# Altium schematic sheet Flash.SchDoc
size A; SheetNumber: 4; SheetTotal: 5
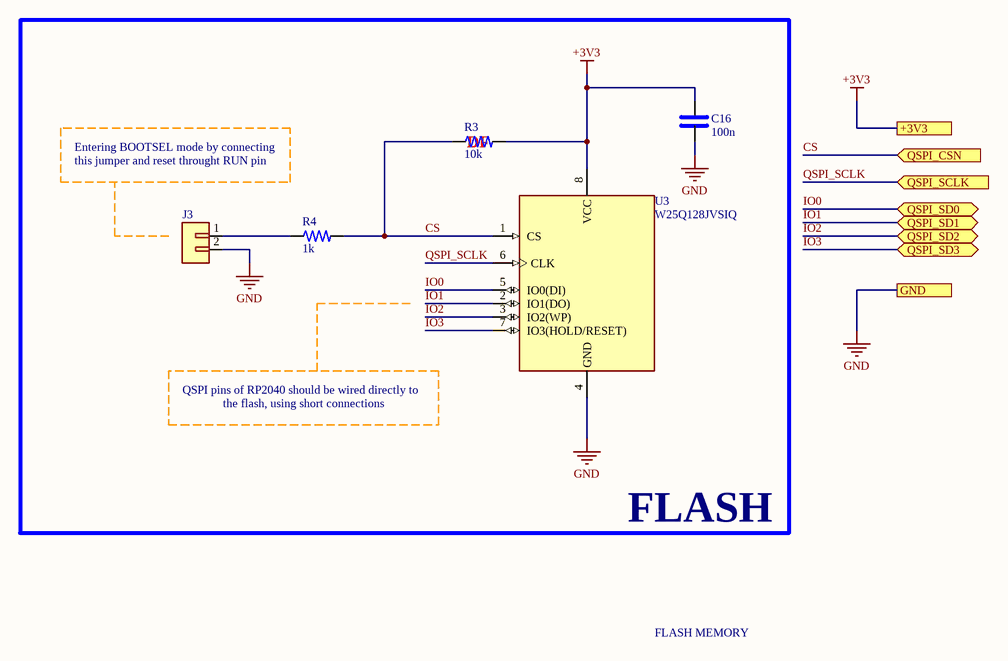
[diagram p0: Flash.SchDoc]

## Parts
C16  100n  [0402 CAP]
J3  2 Position male pin header  [SAMTEC-TMM-101-03-X-D]  (value not drawn)
R3  10k  [0402 RES]
R4  1k  [0402 RES]
U3  W25Q128JVSIQ  [SOIC127P790X216-8N]

## Ports
+3V3 (see Master[4C], Connectors[3B], MCU[1A], Supply[4B]), GND (see Master[4C], Connectors[3C], MCU[1B], Supply[4C]), QSPI_CSN (in, see Master[3C], MCU[1A]), QSPI_SCLK (in, see Master[3C], MCU[1A]), QSPI_SD0 (bidir, see Master[3C], MCU[1A]), QSPI_SD1 (bidir, see Master[3C], MCU[1A]), QSPI_SD2 (bidir, see Master[3C], MCU[1B]), QSPI_SD3 (bidir, see Master[3C], MCU[1B])

## Nets
+3V3: C16.2 R3.2 U3.8(VCC) ; port +3V3
GND: C16.1 J3.2 U3.4(GND) ; port GND
CS: R3.1 R4.2 U3.1(CS) ; port QSPI_CSN
IO0: U3.5(IO0(DI)) ; port QSPI_SD0
IO1: U3.2(IO1(DO)) ; port QSPI_SD1
IO2: U3.3(IO2(WP)) ; port QSPI_SD2
IO3: U3.7(IO3(HOLD/RESET)) ; port QSPI_SD3
QSPI_SCLK: U3.6(CLK) ; port QSPI_SCLK
NetJ3_1: J3.1 R4.1

## Notes on the sheet
- Entering BOOTSEL mode by connecting
- this jumper and reset throught RUN pin
- (near R3) DF
- (near U3) QSPI pins of RP2040 should be wired directly to
- the flash, using short connections
- FLASH
- FLASH MEMORY

## Library data of the parts
C16 = 0402 SMD Capacitor: Ceramic Capacitor, Multilayer, Ceramic, 16V, 10% +Tol, 10% -Tol, X7R, 15% TC, 0.1uF, Surface Mount, 0805; Manufacturer: KEMET; Manufacturer Part Number: C0805C104K4RACTU; Value: 100nF; Multilayer: Yes; ComponentLink1Description: Link; ComponentLink1URL: *; Supplier: Mouser; Supplier Part Number: 80-C0805C104K4R; RoHS: Yes; Category: Ceramic Capacitors; Stock: 114893; Pricing: 1=0.16, 10=0.078, 50=0.078, 100=0.045, 1000=0.034, 10000=0.024 (USD); Mounting Technology: Surface Mount; Pins: 2; Dielectric Material: Ceramic; Package Shape: Rectangular; Case/Package: 0805; Terminal Finish: Nickel; Min Operating Temperature: -55°C; Max Operating Temperature: 125°C; JESD-609 Code: e3; Capacitor Type: Ceramic; Tolerance  (fill in as +-): 10%; Packaging: Tape and Reel; Tolerance (fill in as +-): 10%; Rated DC Voltage (URdc): 16V; Temperature Characteristics Code: X7R; Termination: Wraparound; Reach SVHC Compliant: Yes; RoHS Compliant: Yes; ComponentLink2URL: https://datasheet.ciiva.com:443/pdfs/VipMasterIC/IC/KEME/KEME-S-A0006434815/KEME-S-A0006434815-1.pdf?src-supplier=IHS+Markit; ComponentLink2Description: https://datasheet.ciiva.com:443/pdfs/VipMasterIC/IC/KEME/KEME-S-A0006434815/KEME-S-A0006434815-1.pdf?src-supplier=IHS+Markit; ComponentLink3URL: https://datasheet.ciiva.com/46443/1851736-46443711.pdf?src-supplier=Element14; ComponentLink3Description: https://datasheet.ciiva.com/46443/1851736-46443711.pdf?src-supplier=Element14; ComponentLink4URL: https://datasheet.ciiva.com/46443/1851736-46443710.pdf?src-supplier=Element14; ComponentLink4Description: https://datasheet.ciiva.com/46443/1851736-46443710.pdf?src-supplier=Element14
J3 = SAMTEC-TMM-101-03-X-D
R3 = 0402 SMD Resistor: Fixed Resistor, Metal Glaze/thick Film, 0.125W, 10000ohm, 150V, 10% +/-Tol, 100ppm/Cel, Surface Mount, 0805; Manufacturer: Yageo; Manufacturer Part Number: SR0805KR-0710KL; ComponentLink1Description: Link; ComponentLink1URL: *; Supplier: Digikey; Supplier Part Number: 13-SR0805KR-0710KLCT-ND; RoHS: Yes; Category: Chip SMD Resistors; Stock: 10000; Pricing: 1=0.15, 10=0.08, 50=0.0632, 100=0.0469, 500=0.03468, 1000=0.0306 (USD); ComponentLink2URL: https://datasheet.ciiva.com:443/pdfs/VipMasterIC/IC/YAGO/YAGO-S-A0006645500/YAGO-S-A0006645500-1.pdf?src-supplier=IHS+Markit; ComponentLink2Description: https://datasheet.ciiva.com:443/pdfs/VipMasterIC/IC/YAGO/YAGO-S-A0006645500/YAGO-S-A0006645500-1.pdf?src-supplier=IHS+Markit; ComponentLink3URL: http://www.yageo.com/documents/recent/PYu-SR_20105_RoHS_L_5.pdf?src-supplier=Digikey; ComponentLink3Description: http://www.yageo.com/documents/recent/PYu-SR_20105_RoHS_L_5.pdf?src-supplier=Digikey
R4 = 0402 SMD Resistor: Fixed Resistor, Metal Glaze/thick Film, 0.125W, 1000ohm, 150V, 1% +/-Tol, 100ppm/Cel, Surface Mount, 0805; Manufacturer: Yageo; Manufacturer Part Number: RC0805FR-071KL; Additional Feature: LASER TRIMMABLE; Power: 125mW; Rated Temperature: 70°C; Value: 1kR; Temperature Coefficient: 100ppm/°C; Package Height: 0.5mm; Package Length: 2mm; Package Width: 1.25mm; ComponentLink1Description: Link; ComponentLink1URL: *; Supplier: Future Electronics; Supplier Part Number: 8126013; RoHS: Yes; Category: Chip SMD Resistors; Stock: 1400000; Pricing: 5000=0.0028, 25000=0.0027, 100000=0.0026, 250000=0.0025, 625000=0.0024 (USD); Mounting Technology: Surface Mount; Pins: 2; Package Shape: Rectangular; Case/Package: 0805; Terminal Finish: Nickel; Min Operating Temperature: -55°C; Max Operating Temperature: 155°C; JESD-609 Code: e3; Termination: Wraparound; Resistor Type: FIXED RESISTOR; Construction: Chip; Package Style: SMTMeter; Packaging: Tape and Reel; Technology: METAL GLAZE/THICK FILM; Working Voltage: 150V; Reach SVHC Compliant: Yes; RoHS Compliant: Yes; ComponentLink2URL: https://datasheet.ciiva.com:443/pdfs/VipMasterIC/IC/YAGO/YAGO-S-A0008145938/YAGO-S-A0008145938-1.pdf?src-supplier=IHS+Markit; ComponentLink2Description: https://datasheet.ciiva.com:443/pdfs/VipMasterIC/IC/YAGO/YAGO-S-A0008145938/YAGO-S-A0008145938-1.pdf?src-supplier=IHS+Markit; ComponentLink3URL: https://datasheet.ciiva.com/7941/1686128-7941719.pdf?src-supplier=Element14; ComponentLink3Description: https://datasheet.ciiva.com/7941/1686128-7941719.pdf?src-supplier=Element14
U3 = W25Q128JVSIQ: FLASH - NOR Memory IC 128Mb (16M x 8) SPI - Quad I/O, QPI, DTR 133 MHz 8-SOIC; MF: Winbond Electronics; Price: None; Purchase-URL: https://pricing.snapeda.com/search/part/W25Q128JVSIQ/?ref=eda; Check_prices: https://www.snapeda.com/parts/W25Q128JVSIQ/Winbond+Electronics/view-part/?ref=eda; Value: *; MP: W25Q128JVSIQ; Package: SOIC-8 Winbond; SnapEDA_Link: https://www.snapeda.com/parts/W25Q128JVSIQ/Winbond+Electronics/view-part/?ref=snap; Availability: In Stock